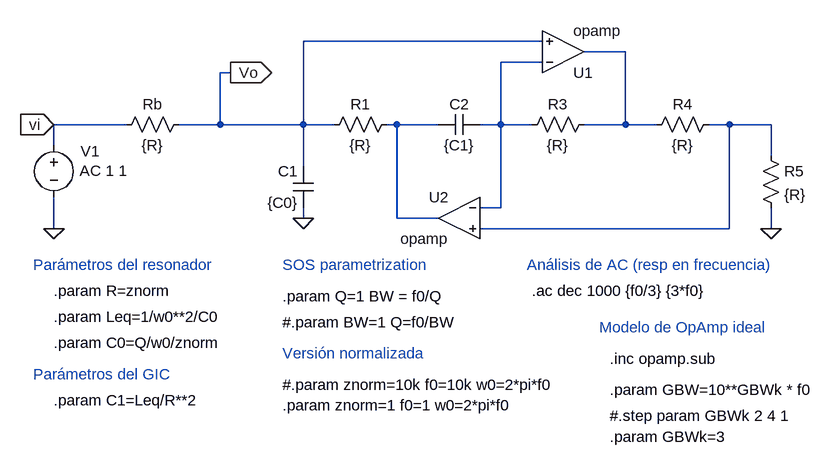
[diagram p0: schematic GIC bandpass real.ASC.asc]
GIC bandpass real.ASC.asc, the LTspice schematic file:
Version 4
SHEET 1 1160 840
WIRE 480 48 112 48
WIRE 608 64 544 64
WIRE 480 80 416 80
WIRE 0 96 -16 96
WIRE -160 176 -272 176
WIRE -16 176 -16 96
WIRE -16 176 -80 176
WIRE 112 176 112 48
WIRE 112 176 -16 176
WIRE 160 176 112 176
WIRE 256 176 240 176
WIRE 320 176 256 176
WIRE 416 176 416 80
WIRE 416 176 384 176
WIRE 464 176 416 176
WIRE 608 176 608 64
WIRE 608 176 544 176
WIRE 656 176 608 176
WIRE 768 176 736 176
WIRE 832 176 768 176
WIRE -272 208 -272 176
WIRE 832 224 832 176
WIRE 112 240 112 176
WIRE 416 304 416 176
WIRE 416 304 384 304
WIRE 112 320 112 304
WIRE 256 320 256 176
WIRE 320 320 256 320
WIRE -272 336 -272 288
WIRE 768 336 768 176
WIRE 768 336 384 336
WIRE 832 336 832 304
FLAG 832 336 0
FLAG 112 320 0
FLAG -272 336 0
FLAG 0 96 Vo
IOPIN 0 96 Out
FLAG -272 176 vi
IOPIN -272 176 In
SYMBOL res -64 160 R90
WINDOW 0 0 56 VBottom 2
WINDOW 3 32 56 VTop 2
SYMATTR InstName Rb
SYMATTR Value {R}
SYMBOL res 144 192 R270
WINDOW 0 32 56 VTop 2
WINDOW 3 0 56 VBottom 2
SYMATTR InstName R1
SYMATTR Value {R}
SYMBOL res 448 192 R270
WINDOW 0 32 56 VTop 2
WINDOW 3 0 56 VBottom 2
SYMATTR InstName R3
SYMATTR Value {R}
SYMBOL res 640 192 R270
WINDOW 0 32 56 VTop 2
WINDOW 3 0 56 VBottom 2
SYMATTR InstName R4
SYMATTR Value {R}
SYMBOL res 816 208 R0
SYMATTR InstName R5
SYMATTR Value {R}
SYMBOL cap 128 304 R180
WINDOW 0 24 56 Left 2
WINDOW 3 24 8 Left 2
SYMATTR InstName C1
SYMATTR Value {C0}
SYMBOL cap 320 192 R270
WINDOW 0 32 32 VTop 2
WINDOW 3 0 32 VBottom 2
SYMATTR InstName C2
SYMATTR Value {C1}
SYMBOL OpAmps\\opamp 512 128 M180
SYMATTR InstName U1
SYMATTR SpiceLine2 GBW={GBW}
SYMBOL OpAmps\\opamp 352 256 M0
SYMATTR InstName U2
SYMATTR SpiceLine2 GBW={GBW}
SYMBOL voltage -272 192 R0
WINDOW 123 40 55 Left 2
WINDOW 39 0 0 Left 0
WINDOW 0 41 25 Left 2
SYMATTR Value2 AC 1 1
SYMATTR InstName V1
SYMATTR Value ""
TEXT 584 536 Left 2 !.inc opamp.sub
TEXT 464 432 Left 2 !.ac dec 1000 {f0/3} {3*f0}
TEXT 456 392 Left 2 ;Análisis de AC (resp en frecuencia)
TEXT 568 488 Left 2 ;Modelo de OpAmp ideal
TEXT -272 600 Left 2 !.param C1=Leq/R**2
TEXT -304 392 Left 2 ;Parámetros del resonador
TEXT 80 440 Left 2 !.param Q=1 BW = f0/Q
TEXT 80 392 Left 2 ;SOS parametrization
TEXT 80 528 Left 2 ;Versión normalizada
TEXT 80 576 Left 2 !#.param znorm=10k f0=10k w0=2*pi*f0
TEXT 584 584 Left 2 !.param GBW=10**GBWk * f0
TEXT 80 608 Left 2 !.param znorm=1 f0=1 w0=2*pi*f0
TEXT -272 432 Left 2 !.param R=znorm
TEXT -272 512 Left 2 !.param C0=Q/w0/znorm
TEXT -272 472 Left 2 !.param Leq=1/w0**2/C0
TEXT -304 560 Left 2 ;Parámetros del GIC
TEXT 80 480 Left 2 !#.param BW=1 Q=f0/BW
TEXT 584 624 Left 2 !#.step param GBWk 2 4 1
TEXT 584 656 Left 2 !.param GBWk=3

The netlist it stands for:
* GIC bandpass real.ASC.asc
Rb Vo vi {R}
R1 Vo N003 {R}
R3 N002 N001 {R}
R4 N001 N004 {R}
R5 N004 0 {R}
C1 0 Vo {C0}
C2 N003 N002 {C1}
XU1 N002 Vo N001 opamp Aol=100K GBW={GBW}  ; pins invin noninvin out
XU2 N002 N004 N003 opamp Aol=100K GBW={GBW}  ; pins invin noninvin out
V1 vi 0 AC 1 1
.inc opamp.sub
.ac dec 1000 {f0/3} {3*f0}
* Análisis de AC (resp en frecuencia)
* Modelo de OpAmp ideal
.param C1=Leq/R**2
* Parámetros del resonador
.param Q=1 BW = f0/Q
* SOS parametrization
* Versión normalizada
#.param znorm=10k f0=10k w0=2*pi*f0
.param GBW=10**GBWk * f0
.param znorm=1 f0=1 w0=2*pi*f0
.param R=znorm
.param C0=Q/w0/znorm
.param Leq=1/w0**2/C0
* Parámetros del GIC
#.param BW=1 Q=f0/BW
#.step param GBWk 2 4 1
.param GBWk=3
.backanno
.end